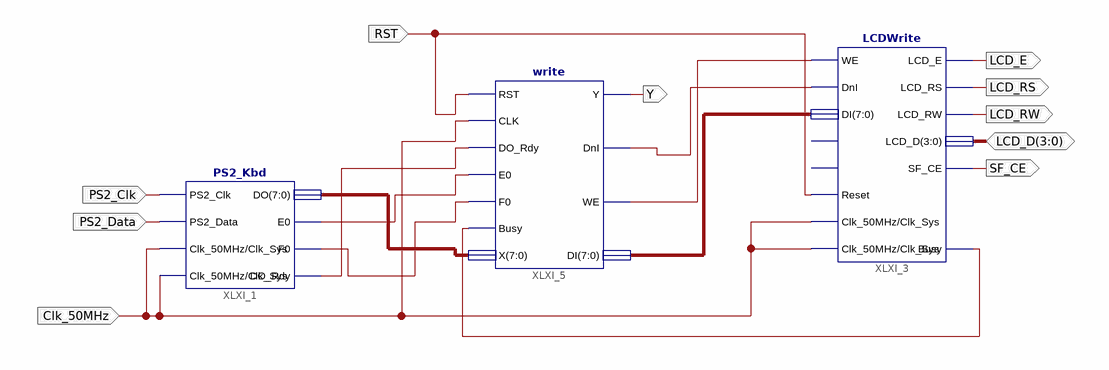
[diagram p0: schematic sheet 1]
// Xilinx ISE schematic writesch.sch (spartan3e) as structural Verilog: 3 symbols, 10 ports
module writesch (
  input  PS2_Clk,
  input  PS2_Data,
  input  Clk_50MHz,
  input  RST,
  inout  [3:0] LCD_D,
  output LCD_E,
  output LCD_RS,
  output LCD_RW,
  output SF_CE,
  output Y
);

  wire XLXN_15, XLXN_26, XLXN_27, XLXN_28, XLXN_29, XLXN_31;
  wire [7:0] XLXN_10, XLXN_14;

  PS2_Kbd XLXI_1 (
    .PS2_Clk(PS2_Clk), .PS2_Data(PS2_Data), .Clk_50MHz(Clk_50MHz), .E0(XLXN_27), .F0(XLXN_28),
    .DO_Rdy(XLXN_26), .DO(XLXN_10), .Clk_Sys(Clk_50MHz));
  LCDWrite XLXI_3 (
    .WE(XLXN_15), .DnI(XLXN_31), .Reset(RST), .DI(XLXN_14), .LCD_E(LCD_E), .LCD_RS(LCD_RS), .LCD_RW(LCD_RW),
    .LCD_D(LCD_D), .SF_CE(SF_CE), .Busy(XLXN_29), .Clk_50MHz(Clk_50MHz), .Clk_Sys(Clk_50MHz));  // open: Cursor, Blink
  write XLXI_5 (
    .RST(RST), .CLK(Clk_50MHz), .DO_Rdy(XLXN_26), .E0(XLXN_27), .F0(XLXN_28), .Busy(XLXN_29), .X(XLXN_10),
    .Y(Y), .DnI(XLXN_31), .WE(XLXN_15), .DI(XLXN_14));
endmodule
